# Altium schematic sheet phase_locked_loop.SchDoc
size A4; Engineer: Amir Hossein Jobeiri; Organization: Simaran; SheetNumber: 22; SheetTotal: 24
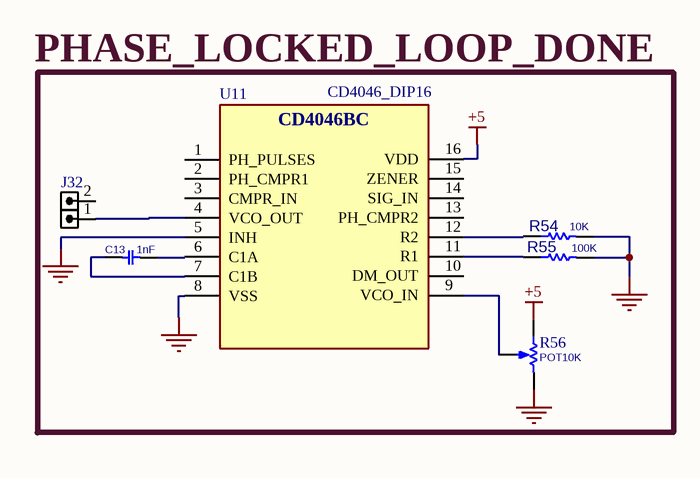
[diagram p0: phase_locked_loop.SchDoc]

## Parts
C13  1nF  [C_CER_D3]
J32  HDRM2  [HDR_M_1X2]  (value not drawn)
R54  10K  [R025W_AX04]
R55  100K  [R025W_AX04]
R56  POT10K  [POT_3296W]
U11  CD4046_DIP16  [DIP_16]

## Blocks framed on the sheet
PHASE_LOCKED_LOOP_DONE: C13 J32 R54-R56 U11

## Nets
+5: R56.1(TOP) U11.16(VDD)
GND: R54.2 R55.2 R56.3(BOT) U11.5(INH) U11.8(VSS)
NetC13_1: C13.1 U11.7(C1B)
NetC13_2: C13.2 U11.6(C1A)
NetJ32_1: J32.1 U11.4(VCO_OUT)
NetR54_1: R54.1 U11.12(R2)
NetR55_1: R55.1 U11.11(R1)
NetR56_2: R56.2(TAP) U11.9(VCO_IN)

Not connected (* = marked no-connect by the designer): J32 2; U11 1(PH_PULSES) 2(PH_CMPR1) 3(CMPR_IN) 10(DM_OUT) 13(PH_CMPR2) 14(SIG_IN) 15(ZENER)

## Notes on the sheet
- (in symbol CD4046_DIP16) CD4046BC

## Library data of the parts
C13 = CAP_THD_CERML: CAP, THD, CER MULTI LAYER,; PARAM: 50V; DESC: CAP, CER MULTI LAYER,; MANF_P#: MANF_PART#; PRICE: 100= 1$; MANF: MANF; PARAM2: PARAM2; ASSEMBLY: ASSEMBLY; VALUE: 1nF
J32 = HDR_M_1X2: CONN, HEADER, Male, pitch: 2.54mm, 2POS; VALUE: HDRM2
R54 R55 = RES_THD: RESISTOR, THD; MANF_P#: RK73H1ETTP4701F; MANF: KOA SPEER; PARAM: 0.063W; DESC: DESCRIPTION; DIST#: MOUSER; PARAM2: 1%; ASSEMBLY: ASSEMBLY; PRICE: 100= 0.5$
  R54: VALUE: 10K
  R55: VALUE: 100K
R56 = RES_THD_POT_3296W: RESISTOR, THD, Potentiometer; VALUE: POT10K
U11 = CD4046_DIP16: CREATED BY J / Micropower Phase-Locked Loop; MANF: FAIRCHILD; VALUE: CD4046_DIP16; PARAM: *; PARAM1: *; MANF_P#: *